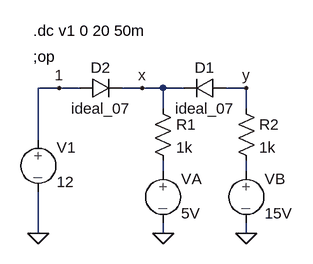
[diagram p0: schematic schaltung_mit_2_dioden.asc]
schaltung_mit_2_dioden.asc, the LTspice schematic file:
Version 4
SHEET 1 880 680
WIRE 160 128 128 128
WIRE 192 128 160 128
WIRE 288 128 256 128
WIRE 320 128 288 128
WIRE 352 128 320 128
WIRE 448 128 416 128
WIRE 320 160 320 128
WIRE 448 160 448 128
WIRE 128 208 128 128
WIRE 320 256 320 240
WIRE 448 256 448 240
WIRE 128 352 128 288
WIRE 320 352 320 336
WIRE 448 352 448 336
FLAG 320 352 0
FLAG 448 352 0
FLAG 128 352 0
FLAG 288 128 x
FLAG 448 128 y
FLAG 160 128 1
SYMBOL diode 416 112 R90
WINDOW 0 0 32 VBottom 2
WINDOW 3 32 32 VTop 2
SYMATTR InstName D1
SYMATTR Value ideal_07
SYMBOL diode 192 144 R270
WINDOW 0 32 32 VTop 2
WINDOW 3 0 32 VBottom 2
SYMATTR InstName D2
SYMATTR Value ideal_07
SYMBOL res 304 144 R0
SYMATTR InstName R1
SYMATTR Value 1k
SYMBOL res 432 144 R0
SYMATTR InstName R2
SYMATTR Value 1k
SYMBOL source-V 320 240 R0
SYMATTR InstName VA
SYMATTR Value 5V
SYMBOL source-V 448 240 R0
SYMATTR InstName VB
SYMATTR Value 15V
SYMBOL source-V 128 192 R0
SYMATTR InstName V1
SYMATTR Value 12
TEXT 120 80 Left 2 !;op
TEXT 120 40 Left 2 !.dc v1 0 20 50m

The netlist it stands for:
* schaltung_mit_2_dioden.asc
D1 y x ideal_07
D2 1 x ideal_07
R1 x N001 1k
R2 y N002 1k
VA N001 0 5V
VB N002 0 15V
V1 1 0 12
.model D D
.lib standard.dio
;op
.dc v1 0 20 50m
.backanno
.end